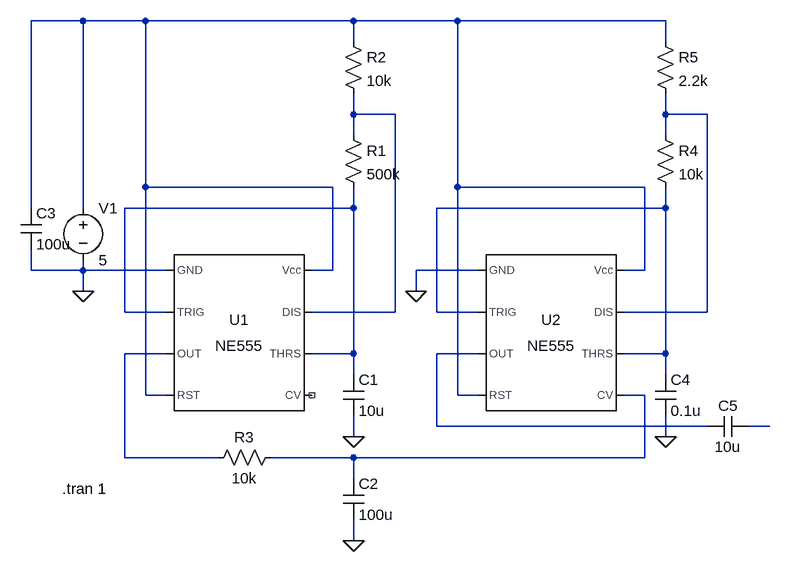
[diagram p0: schematic 556.asc]
556.asc, the LTspice schematic file:
Version 4
SHEET 1 1012 680
WIRE -48 -304 -128 -304
WIRE 48 -304 -48 -304
WIRE 368 -304 48 -304
WIRE 528 -304 368 -304
WIRE 848 -304 528 -304
WIRE 368 -272 368 -304
WIRE 848 -272 848 -304
WIRE 368 -160 368 -192
WIRE 432 -160 368 -160
WIRE 848 -160 848 -192
WIRE 912 -160 848 -160
WIRE 368 -128 368 -160
WIRE 848 -128 848 -160
WIRE 48 -48 48 -304
WIRE 336 -48 48 -48
WIRE 528 -48 528 -304
WIRE 816 -48 528 -48
WIRE -128 -16 -128 -304
WIRE -48 -16 -48 -304
WIRE 368 -16 368 -48
WIRE 368 -16 16 -16
WIRE 848 -16 848 -48
WIRE 848 -16 496 -16
WIRE -128 80 -128 48
WIRE -48 80 -48 64
WIRE -48 80 -128 80
WIRE 80 80 -48 80
WIRE 336 80 336 -48
WIRE 336 80 304 80
WIRE 560 80 464 80
WIRE 816 80 816 -48
WIRE 816 80 784 80
WIRE -48 112 -48 80
WIRE 464 112 464 80
WIRE 16 144 16 -16
WIRE 80 144 16 144
WIRE 432 144 432 -160
WIRE 432 144 304 144
WIRE 496 144 496 -16
WIRE 560 144 496 144
WIRE 912 144 912 -160
WIRE 912 144 784 144
WIRE 80 208 16 208
WIRE 368 208 368 -16
WIRE 368 208 304 208
WIRE 560 208 496 208
WIRE 848 208 848 -16
WIRE 848 208 784 208
WIRE 368 240 368 208
WIRE 848 240 848 208
WIRE 48 272 48 -48
WIRE 80 272 48 272
WIRE 528 272 528 -48
WIRE 560 272 528 272
WIRE 816 272 784 272
WIRE 496 320 496 208
WIRE 912 320 496 320
WIRE 1008 320 976 320
WIRE 368 336 368 304
WIRE 848 336 848 304
WIRE 16 368 16 208
WIRE 160 368 16 368
WIRE 368 368 240 368
WIRE 816 368 816 272
WIRE 816 368 368 368
WIRE 368 400 368 368
WIRE 368 496 368 464
FLAG 368 336 0
FLAG -48 112 0
FLAG 368 496 0
FLAG 464 112 0
FLAG 848 336 0
SYMBOL Misc\\NE555 192 176 R0
SYMATTR InstName U1
SYMBOL Misc\\NE555 672 176 R0
SYMATTR InstName U2
SYMBOL res 352 -144 R0
SYMATTR InstName R1
SYMATTR Value 500k
SYMBOL cap 352 240 R0
SYMATTR InstName C1
SYMATTR Value 10u
SYMBOL voltage -48 -32 R0
WINDOW 123 0 0 Left 0
WINDOW 39 0 0 Left 0
SYMATTR InstName V1
SYMATTR Value 5
SYMBOL res 352 -288 R0
SYMATTR InstName R2
SYMATTR Value 10k
SYMBOL res 256 352 R90
WINDOW 0 0 56 VBottom 2
WINDOW 3 32 56 VTop 2
SYMATTR InstName R3
SYMATTR Value 10k
SYMBOL cap 352 400 R0
SYMATTR InstName C2
SYMATTR Value 100u
SYMBOL cap -144 -16 R0
SYMATTR InstName C3
SYMATTR Value 100u
SYMBOL res 832 -144 R0
SYMATTR InstName R4
SYMATTR Value 10k
SYMBOL res 832 -288 R0
SYMATTR InstName R5
SYMATTR Value 2.2k
SYMBOL cap 832 240 R0
SYMATTR InstName C4
SYMATTR Value 0.1u
SYMBOL cap 976 304 R90
WINDOW 0 0 32 VBottom 2
WINDOW 3 32 32 VTop 2
SYMATTR InstName C5
SYMATTR Value 10u
TEXT -80 416 Left 2 !.tran 1

The netlist it stands for:
* 556.asc
XU1 0 N004 N006 N001 NC_01 N004 N002 N001 NE555  ; pins GND TRIG OUT RST CV THRS DIS Vcc
XU2 0 N005 N007 N001 N008 N005 N003 N001 NE555  ; pins GND TRIG OUT RST CV THRS DIS Vcc
R1 N002 N004 500k
C1 N004 0 10u
V1 N001 0 5
R2 N001 N002 10k
R3 N008 N006 10k
C2 N008 0 100u
C3 N001 0 100u
R4 N003 N005 10k
R5 N001 N003 2.2k
C4 N005 0 0.1u
C5 N009 N007 10u
.tran 1
.lib NE555.sub
.backanno
.end